# EAGLE design Gimbal-Mastboard (EAGLE 8.4.3)
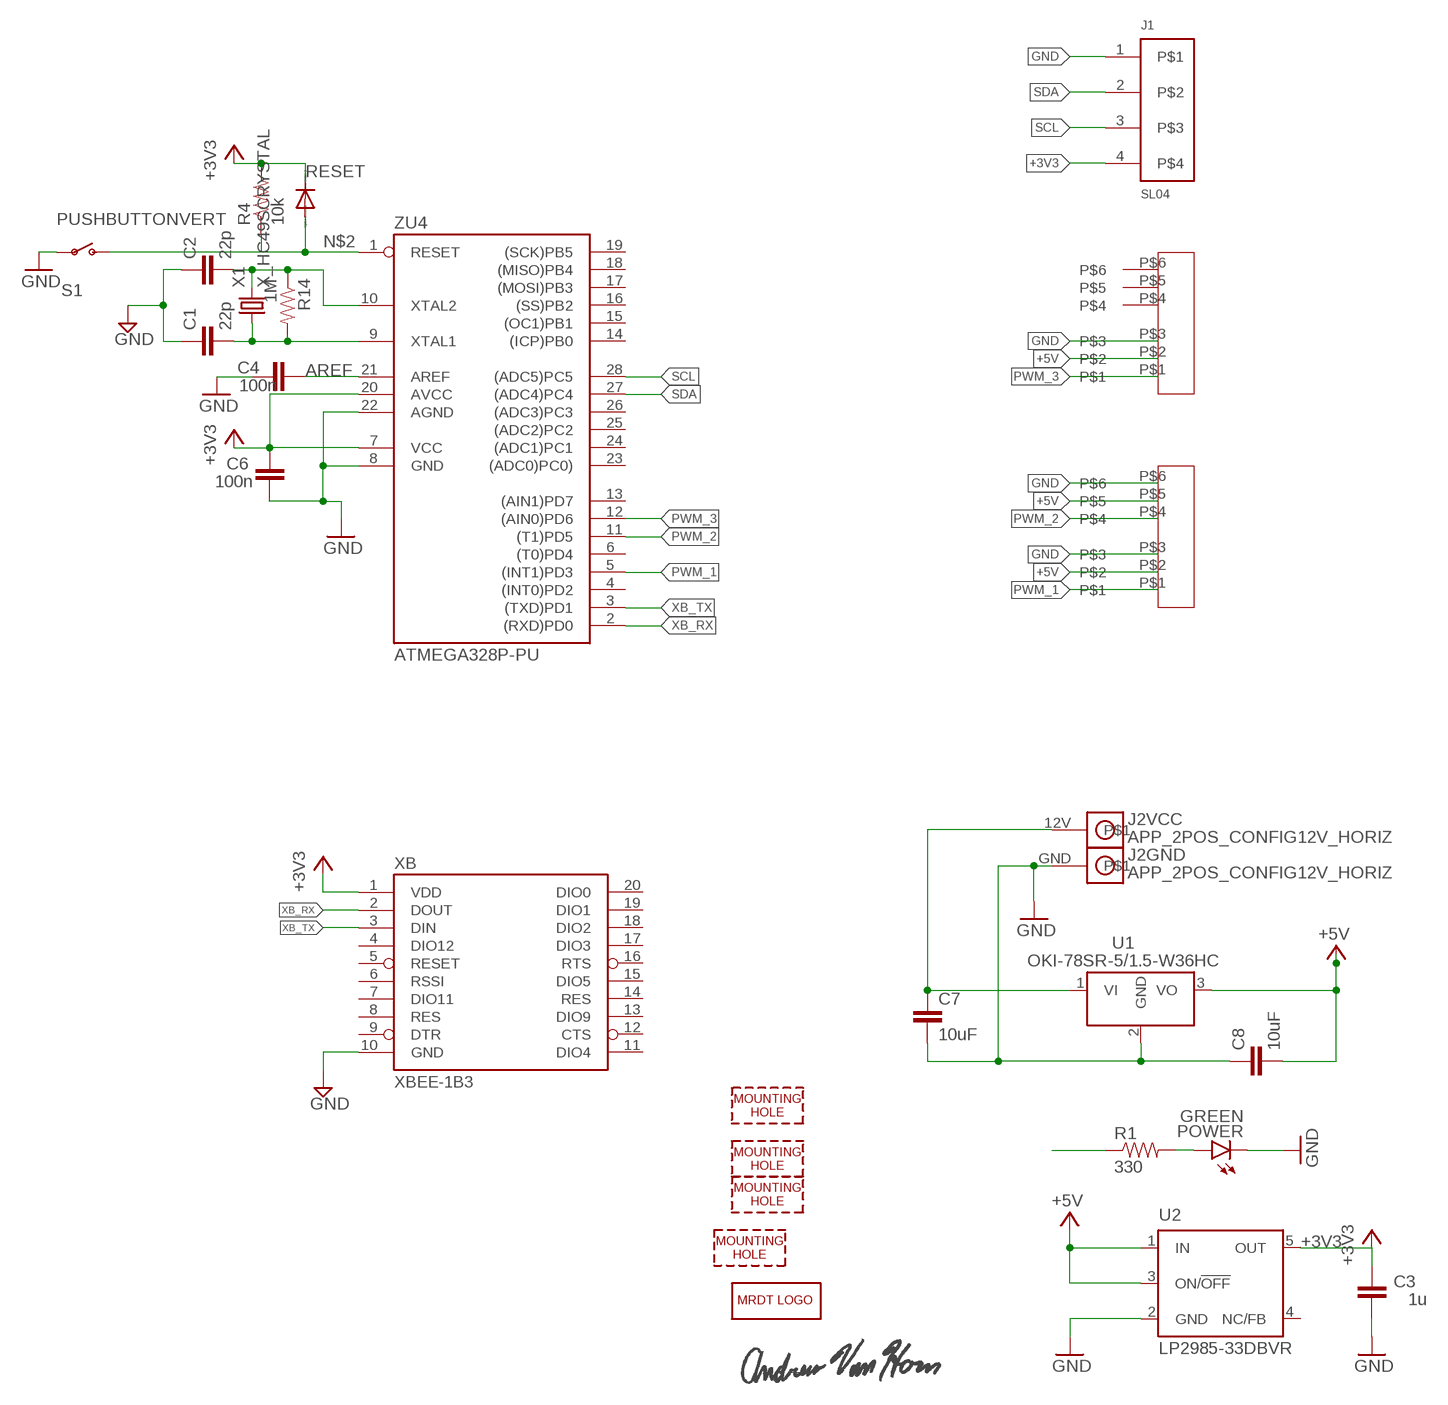
[diagram p0: schematic, sheet 1]

## Parts
C1  22p  CAP0603-CAP  [0603-CAP]
C2  22p  CAP0603-CAP  [0603-CAP]
C3  1u  C-EU0603-RND  [C0603-ROUND]
C4  100n  C-EU0603-RND  [C0603-ROUND]
C6  100n  C-EU0603-RND  [C0603-ROUND]
C7  10uF  CAP0805  [0805]
C8  10uF  CAP0805  [0805]
H1  MOUNTING_HOLE#4  [#4_SCREW]
H2  MOUNTING_HOLE#4  [#4_SCREW]
H3  MOUNTING_HOLE#4  [#4_SCREW]
H4  MOUNTING_HOLE#4  [#4_SCREW]
J1  SL04  [MOLEX_SL_04_TH]
J2  APP_2POS_CONFIG12V_HORIZ  [APP45_12V_HORIZ_CONFIG]
LOGO1  MRDT_LOGO  [MRDT_LOGO]
POWER  GREEN  LED-GREEN1206  [LED-1206]
R1  330  0.22OHM-1/4W-1%(0805)  [0805]
R4  10k  0.22OHM-1/4W-1%(0805)  [0805]
R14  1M  RESISTOR0603  [0603-RES]
RESET  CD1206-S01575  DIODE-MINIMELF  [MINIMELF]
S1  PUSHBUTTONVERT  [APEM-MJTP1243]
U1  OKI-78SR-5/1.5-W36HC  [OKI-78SR_HORIZ]
U2  LP2985-33DBVR  LP2985-XXDBVR33  [SOT23-DBV]
U$1  2X3_BOX_HEADER_FEMALE  [2X3_BOX_HEADER_FEMALE]
U$2  2X3_BOX_HEADER_FEMALE  [2X3_BOX_HEADER_FEMALE]
U$3  ANDREW_VAN_HORN_SIGNATURE  [ANDREW_VAN_HORN_SIGNATURE]
X1  X_HC49SCRYSTAL  [HC-49]
XB  XBEE-1B3  [XBEE-SMD]
ZU4  ATMEGA328P-PU  [DIL28-3]

## Nets
12V: C7.1 J2.12V U1.1(VI)
+3V3: C3.2 C6.2 J1.4 R1.1 R4.2 RESET.C U2.5(OUT) XB.1(VDD) ZU4.7(VCC) ZU4.20(AVCC)
+5V: C8.2 U1.3(VO) U2.1(IN) U2.3(ON/!OFF) U$1.P$2 U$2.P$2 U$2.P$5
AREF [aref]: C4.2 ZU4.21(AREF)
GND: C1.1 C2.1 C3.1 C4.1 C6.1 C7.2 C8.1 J1.1 J2.GND POWER.C S1.P$1(P) U1.2(GND) U2.2(GND) U$1.P$3 U$2.P$3 U$2.P$6 XB.10(GND) ZU4.8(GND) ZU4.22(AGND)
N$1: C2.2 R14.1 X1.P$2 ZU4.10(XTAL2)
N$2: R4.1 RESET.A S1.P$2(S) ZU4.1(RESET)
N$10: C1.2 R14.2 X1.P$1 ZU4.9(XTAL1)
N$17: POWER.A R1.2
PWM_1: U$2.P$1 ZU4.5((INT1)PD3)
PWM_2: U$2.P$4 ZU4.11((T1)PD5)
PWM_3: U$1.P$1 ZU4.12((AIN0)PD6)
SCL: J1.3 ZU4.28((ADC5)PC5)
SDA: J1.2 ZU4.27((ADC4)PC4)
XB_RX: XB.2(DOUT) ZU4.2((RXD)PD0)
XB_TX: XB.3(DIN) ZU4.3((TXD)PD1)
Unconnected: U2.4(NC/FB) U$1.P$4 U$1.P$5 U$1.P$6 XB.4(DIO12) XB.5(RESET) XB.6(RSSI) XB.7(DIO11) XB.8(RES) XB.9(DTR) XB.11(DIO4) XB.12(CTS) XB.13(DIO9) XB.14(RES) XB.15(DIO5) XB.16(RTS) XB.17(DIO3) XB.18(DIO2) XB.19(DIO1) XB.20(DIO0) ZU4.4((INT0)PD2) ZU4.6((T0)PD4) ZU4.13((AIN1)PD7) ZU4.14((ICP)PB0) ZU4.15((OC1)PB1) ZU4.16((SS)PB2) ZU4.17((MOSI)PB3) ZU4.18((MISO)PB4) ZU4.19((SCK)PB5) ZU4.23((ADC0)PC0)) ZU4.24((ADC1)PC1) ZU4.25((ADC2)PC2) ZU4.26((ADC3)PC3)

## Library data of the parts
C1 C2 = SparkFun-Passives:CAP: Capacitor Standard 0603 ceramic capacitor, and 0.1" leaded capacitor.
C3 C4 C6 = SmartPrj:C-EU: CAPACITOR, European symbol
C7 C8 = SparkFun-Capacitors:CAP: Capacitor Standard 0603 ceramic capacitor, and 0.1" leaded capacitor.
H1-H4 = MRDT-Hardware:MOUNTING_HOLE: Mounting hole for M6 bolt. Standard use mounting hole for: Tiva C Connected - M6 Anderson Powerpole Mounting Wing - M8 Most frame-mounted PCB's - M8
J1 = MRDT-Connectors:SL04
J2 = MRDT-Connectors:APP_2POS_CONFIG; COLOR1: YELLOW; COLOR2: BLACK
LOGO1 = MRDT-Hardware:MRDT_LOGO
POWER = SparkFun-LED:LED-GREEN: Various green LEDs Green LEDs used in SFE Production 0603- DIO-00821 LARGE- DIO-00862 LILYPAD- DIO-09910; PROD_ID: DIO-00862
R1 R4 = SparkFun-Resistors:0.22OHM-1/4W-1%(0805): RES-09883; PROD_ID: RES-09883; VALUE: 0.22
R14 = SparkFun-Resistors:RESISTOR: Resistor Basic schematic elements and footprints for 0603, 1206, and PTH resistors.
RESET = diode:DIODE-: DIODE
S1 = MRDT-UserInput:PUSHBUTTON; PARTNO: MJTP1243
U1 = MRDT-ICs:OKI-78SR-*/1.5-W36?C: 4.95W DC/DC Converter Manufacturer: Murata; VOUT: +5v
U2 = SmartPrj:LP2985-XXDBVR: ULTRALOW-POWER 50-mA LOW-DROPOUT LINEAR REGULATORS 50-mA Low-Dropout Regulator Source: http://focus.ti.com/lit/ds/symlink/tps77001.pdf
U$1 U$2 = Andrew's Library:2X3_BOX_HEADER_FEMALE
U$3 = MRDT-Signatures:ANDREW_VAN_HORN_SIGNATURE
X1 = MRDT-2014-All:X_HC49SCRYSTAL: CRYSTAL METAL CAN, 16MHZ, 18PF, HC-49/US
XB = SparkFun:XBEE-1
ZU4 = SmartPrj:ATMEGA328P-: MICROCONTROLLER 4 Kbytes FLASH 128 bytes SRAM 256 bytes EEPROM UART 6-channel 10 bit ADC

## Net classes
0 default: width 0.254 mm, clearance 0.254 mm
2 gnd: width 0.305 mm, drill 0.559 mm, clearance 0.254 mm
3 usbvcc: width 0.508 mm, drill 0.61 mm, clearance 0.254 mm
4 aref: width 0.406 mm, drill 0.61 mm, clearance 0.254 mm

## Board
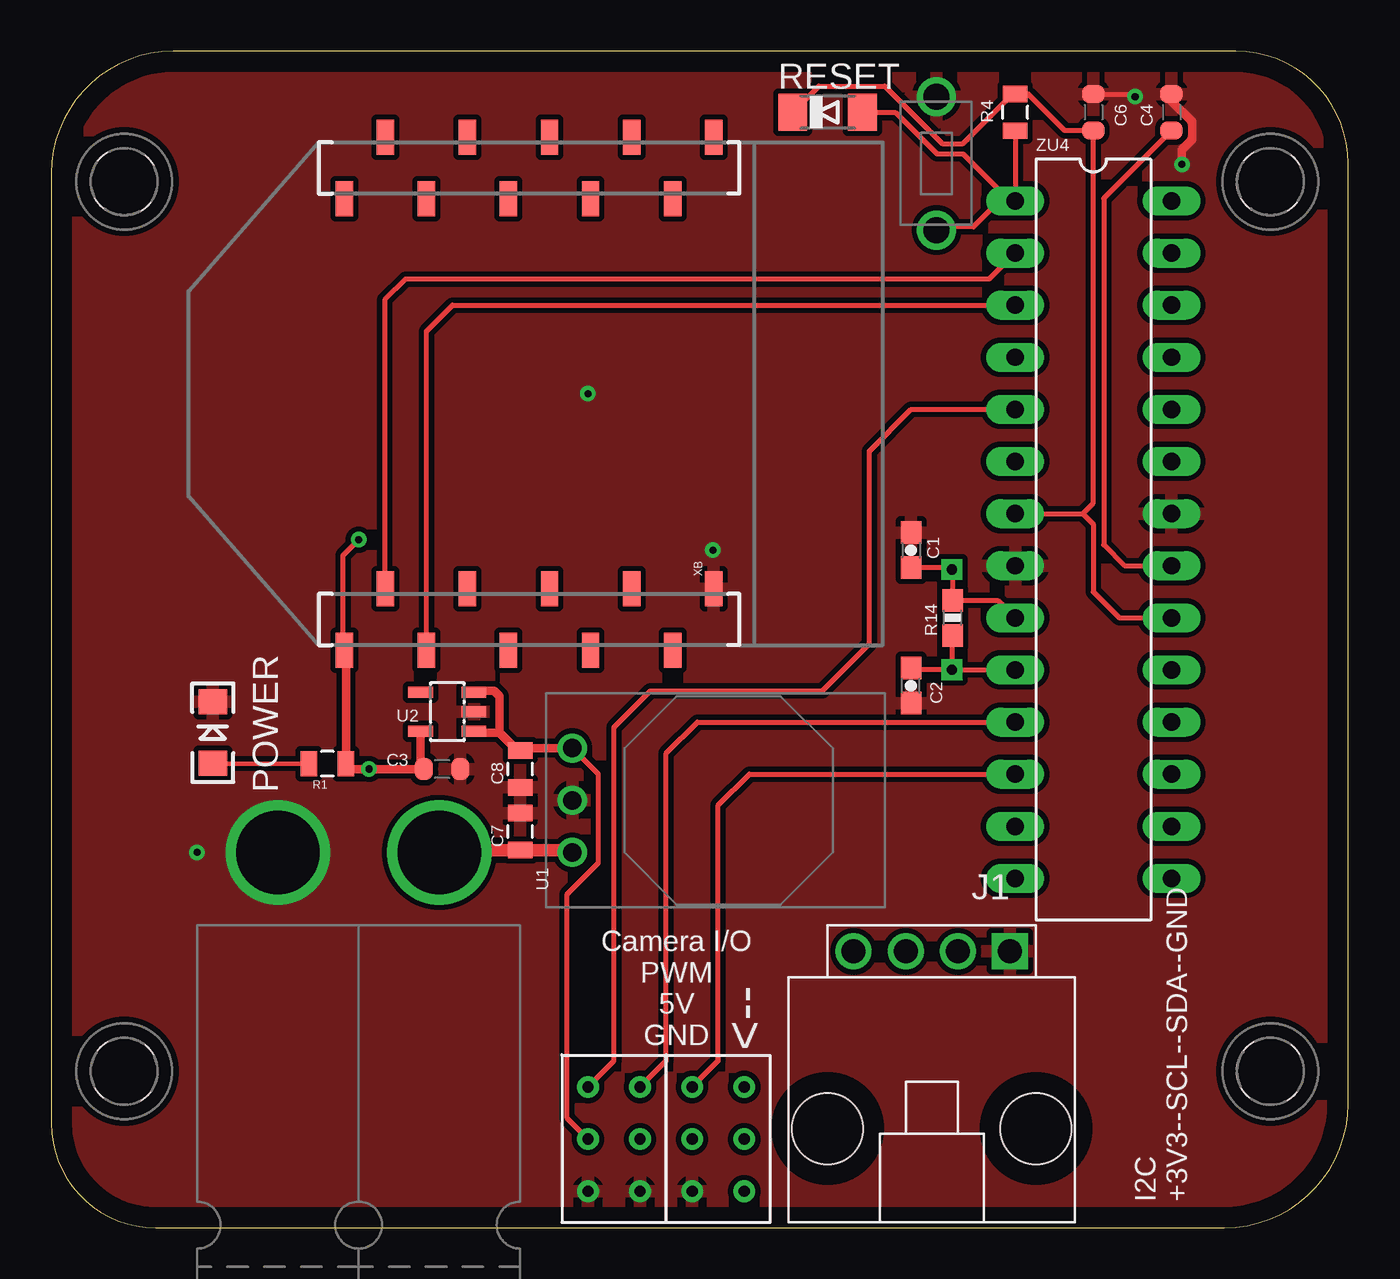
[diagram p1: board, top side]
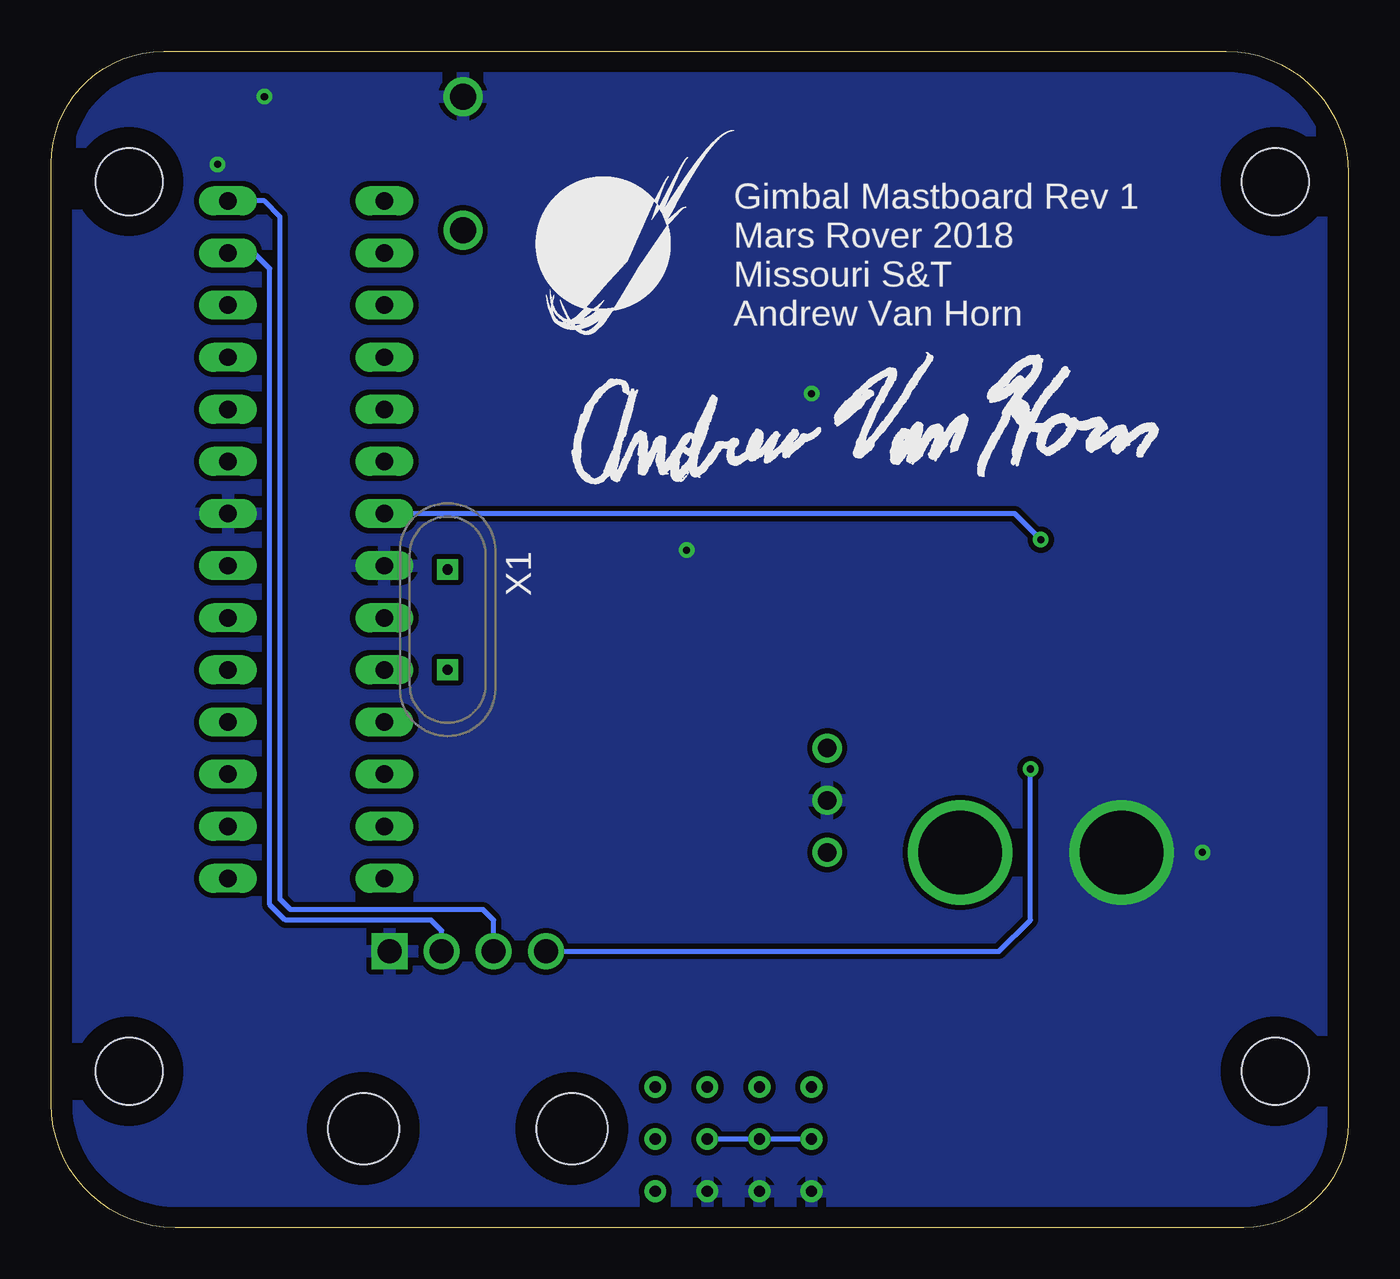
[diagram p2: board, bottom side, seen from below]

Size 63.23 x 57.33 mm. Coordinates in mm from the lower left corner, seen from the top.
Outline: 0,51.39 0,5.08 arc90 5.08,0 57.19,0 arc90 63.23,6.04 63.23,51.86 arc90 57.76,57.33 5.94,57.33 arc90 0,51.39
Copper layers (1*16): Top 0.035mm / dielectric 1.5mm / Bottom 0.035mm
Design rules "default": minimum track width 6mil, minimum drill 0.35mm, track to track 6mil, track to pad 6mil, pad to pad 6mil, via to via 6mil, smd to smd 6mil, copper to edge 40mil, drill to drill 6mil, minimum pad ring 10mil, minimum via ring 8mil, stop-mask expansion 4mil, vias tented up to drill 0mil, thermal gap 10mil

### Footprints (pad centres in the part's own frame; a part is rotated, then mirrored left to right if it is on the bottom)
0603-CAP = smd 1.1 x 1: 1 -0.85,0; 2 0.85,0
C0603-ROUND = smd 0.898 x 1.1: 1 -0.889,0; 2 0.889,0
0805 = smd 0.8 x 1.2: 1 -0.9,0; 2 0.9,0
#4_SCREW = hole 3.264: 0,0
MOLEX_SL_04_TH = drill 1.168 square: 1 -3.81,0 | drill 1.168: 2 -1.27,0; 3 1.27,0; 4 3.81,0 | hole 3.454: -5.08,8.636; 5.08,8.636
APP45_12V_HORIZ_CONFIG = drill 4.064: 12V 28.194,3.937; GND 28.194,11.811
LED-1206 = smd 1.2 x 1.4: A -1.5,0; C 1.5,0
0603-RES = smd 1.1 x 1: 1 -0.85,0; 2 0.85,0
MINIMELF = smd 1.4 x 1.8: A 1.7,0; C -1.7,0
APEM-MJTP1243 = drill 1.27: P$1 -0.254,1.753; P$2 6.248,1.753
OKI-78SR_HORIZ = drill 0.9 pad 1.422: 1 0,0; 2 -2.54,0; 3 -5.08,0
SOT23-DBV = smd 0.55 x 1.2: 1 -0.95,-1.3; 2 0,-1.3; 3 0.95,-1.3; 4 0.95,1.3; 5 -0.95,1.3
2X3_BOX_HEADER_FEMALE = drill 0.55: P$1 1.524,1.27; P$2 4.064,1.27; P$3 6.604,1.27; P$4 1.524,3.81; P$5 4.064,3.81; P$6 6.604,3.81
HC-49 = drill 0.5 square: P$1 3.235,2.325; P$2 8.115,2.325
XBEE-SMD = smd 1.7 x 0.85: 1 -12.5,20; 2 -9.5,18; 3 -12.5,16; 4 -9.5,14; 5 -12.5,12; 6 -9.5,10; 7 -12.5,8; 8 -9.5,6; 9 -12.5,4; 10 -9.5,2; 11 12.5,2; 12 9.5,4; 13 12.5,6; 14 9.5,8; 15 12.5,10; 16 9.5,12; 17 12.5,14; 18 9.5,16; 19 12.5,18; 20 9.5,20
DIL28-3 = drill 0.85 pad 1.422 long: 1 -16.51,-3.81; 2 -13.97,-3.81; 3 -11.43,-3.81; 4 -8.89,-3.81; 5 -6.35,-3.81; 6 -3.81,-3.81; 7 -1.27,-3.81; 8 1.27,-3.81; 9 3.81,-3.81; 10 6.35,-3.81; 11 8.89,-3.81; 12 11.43,-3.81; 13 13.97,-3.81; 14 16.51,-3.81; 15 16.51,3.81; 16 13.97,3.81; 17 11.43,3.81; 18 8.89,3.81; 19 6.35,3.81; 20 3.81,3.81; 21 1.27,3.81; 22 -1.27,3.81; 23 -3.81,3.81; 24 -6.35,3.81; 25 -8.89,3.81; 26 -11.43,3.81; 27 -13.97,3.81; 28 -16.51,3.81

### Placement (x,y rotation side)
C1  41.91,33.02 270 top
C2  41.91,26.42 90 top
C3  19.05,22.35 180 top
C4  54.61,54.36 270 top
C6  50.8,54.36 270 top
C7  22.86,19.3 90 top
C8  22.86,22.35 90 top
H1  3.56,50.98 0 top
H2  3.56,7.62 0 top
H3  59.44,7.62 0 top
H4  59.44,50.98 0 top
J1  42.93,13.46 180 top
J2  22.86,-9.91 90 top
LOGO1  39.62,42.67 0 bottom
POWER  7.87,24.13 90 top
R1  13.46,22.61 180 top
R4  46.99,54.36 90 top
R14  43.94,29.72 90 top
RESET  37.85,54.36 0 top
S1  41.4,54.86 270 top
U1  25.4,18.29 270 top
U2  19.3,25.15 90 top
U$1  29.97,8.38 270 top
U$2  24.89,8.38 270 top
U$3  39.12,35.31 0 bottom
X1  46.23,35.31 270 bottom
XB  34.29,40.64 90 top
ZU4  50.8,33.53 270 top

### Tracks (layer width: path | path; a pad name or v marks a point on that pad's centre or on a via)
12V
  Top 0.61: U1.1 25.28,18.4 C7.1 19.04,18.4 J2.12V
+3V3  (via drill 0.35)
  Top 0.254: 14.22,28.07 XB.1 14.22,28.21 14.22,32.77 v14.99,33.53 | ZU4.20 52.07,29.72 50.8,30.99 50.8,34.29 50.29,34.8 | ZU4.7 50.29,34.8 | 14.22,22.74 R1.1 | 50.29,34.8 50.8,35.31 C6.2 49.4,53.47 47.61,55.26 R4.2 46.87,55.26 44.45,52.83 43.43,52.83 40.64,55.63 37.42,55.63 RESET.C | 18,22.61 18,22.51 C3.2
  Top 0.406: U2.5 18,22.61 | C3.2 v15.49,22.35 14.62,22.35 R1.1 14.36,28.07 XB.1
  Bottom 0.254: J1.4 17.02,13.46 15.49,14.99 v15.49,22.35 | ZU4.7 16.26,34.8 v14.99,33.53
+5V
  Top 0.254: U$2.P$2 25.15,5.33 25.15,16.26 26.67,17.78 26.67,22.1 U1.3
  Top 0.406: U1.3 22.98,23.37 C8.2 22.72,23.25 21.84,24.13 | 21.84,24.13 20.67,24.13 U2.1 | 21.84,24.13 21.84,25.91 21.59,26.16 20.67,26.16 U2.3
  Bottom 0.254: U$2.P$2 U$2.P$5 U$1.P$2
AREF
  Top 0.254: C4.2 51.31,50.16 51.31,33.27 52.32,32.26 ZU4.21
GND  (via drill 0.35)
  Top 0.254: C6.1 52.7,55.24 v52.83,55.12
  Top 0.406: C4.1 54.61,54.9 55.62,53.9 55.62,53.04 55.12,52.54 v55.12,51.82
  other vias: 7.11,18.29 32.26,33.02 26.16,40.64
  pour Top: 0.25,0.51 62.99,0 62.99,57.66 0.25,57.15
  pour Bottom: 0.25,0.51 62.74,0 62.74,57.66 0.25,57.4
N$1
  Top 0.254: X1.P$2 43.94,27.23 R14.1 | X1.P$2 46.98,27.19 ZU4.10 | X1.P$2 41.98,27.19 C2.2
N$2
  Top 0.254: RESET.A 41.15,54.36 43.18,52.32 44.45,52.32 46.74,50.04 ZU4.1 | R4.1 ZU4.1 | ZU4.1 46.23,50.04 44.96,48.77 43.31,48.77 S1.P$2
N$10
  Top 0.254: C1.2 43.8,32.17 X1.P$1 43.94,32.03 R14.2 46.14,30.57 ZU4.9
N$17
  Top 0.254: POWER.A R1.2
PWM_1
  Top 0.254: U$2.P$1 27.43,8.13 27.43,24.38 29.21,26.16 37.59,26.16 39.88,28.45 39.88,37.85 41.91,39.88 ZU4.5
PWM_2
  Top 0.254: ZU4.11 31.5,24.64 29.97,23.11 29.97,8.38 | 29.97,8.38 29.97,8.13 | U$2.P$4 29.97,8.13 | 29.97,8.13 29.97,8.38
PWM_3
  Top 0.254: ZU4.12 34.04,22.1 32.51,20.57 32.51,8.38 | 32.51,8.38 32.51,8.13 | U$1.P$1 32.51,8.13 | 32.51,8.13 32.51,8.38
SCL
  Bottom 0.254: J1.3 41.66,14.99 42.16,15.49 51.56,15.49 52.07,16 52.07,49.28 52.83,50.04 ZU4.28
SDA
  Bottom 0.254: J1.2 44.2,14.48 44.7,14.99 51.82,14.99 52.58,15.75 52.58,46.74 53.34,47.5 ZU4.27
XB_RX
  Top 0.254: XB.2 16.29,31.72 16.26,31.75 16.26,45.21 17.27,46.23 45.72,46.23 ZU4.2
XB_TX
  Top 0.254: XB.3 18.29,28.7 18.29,43.69 19.56,44.96 ZU4.3

### Text on the board
tNames: Camera I/O / PWM / 5V / GND | <-- | I2C / +3V3--SCL--SDA--GND
bNames: Gimbal Mastboard Rev 1 / Mars Rover 2018 / Missouri S&T / Andrew Van Horn